# EAGLE design modular_expansion_system_base_smd (EAGLE 9.2.1)
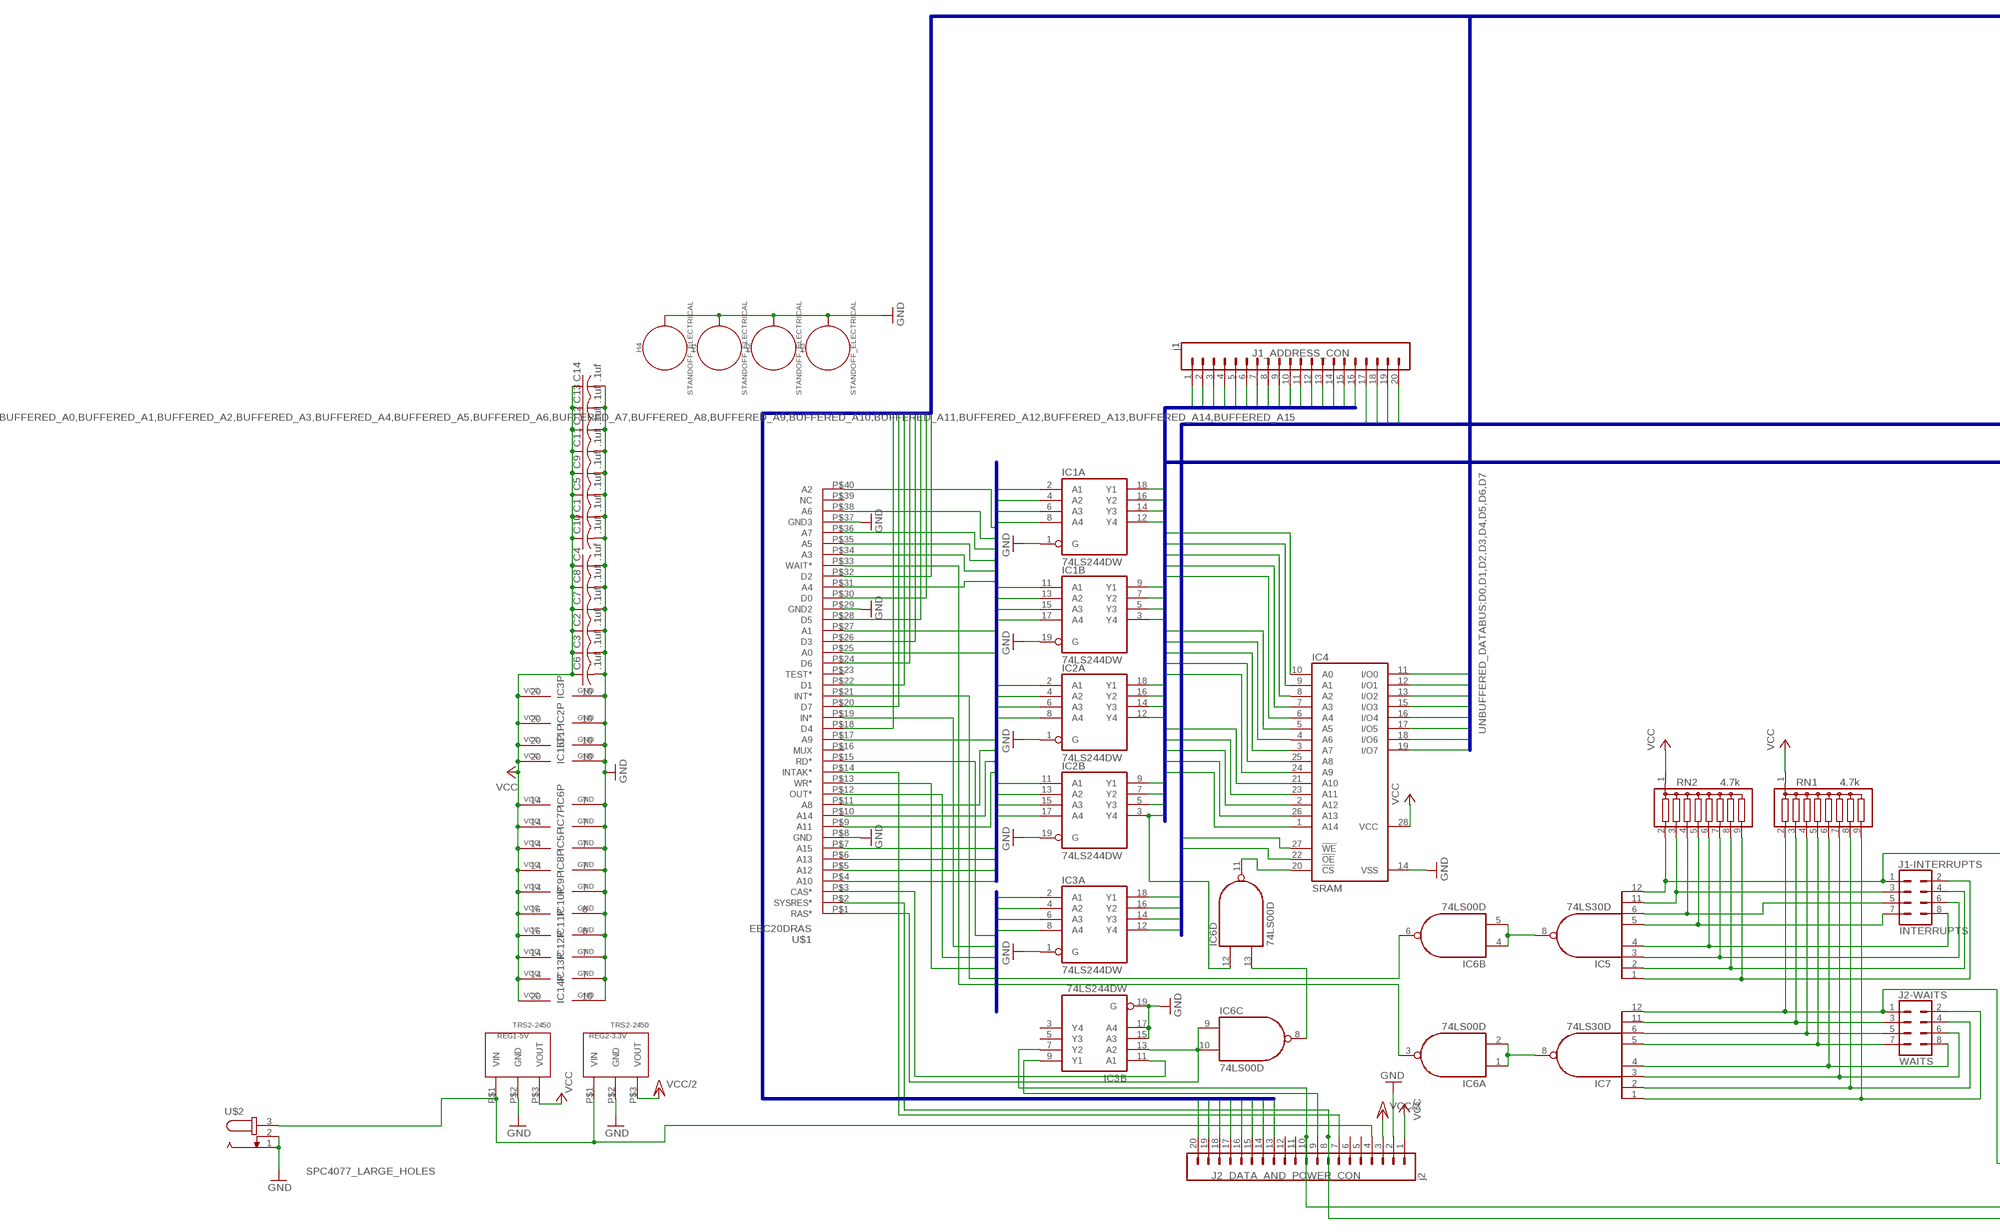
[diagram p0: schematic, sheet 1, part 1 of 3]
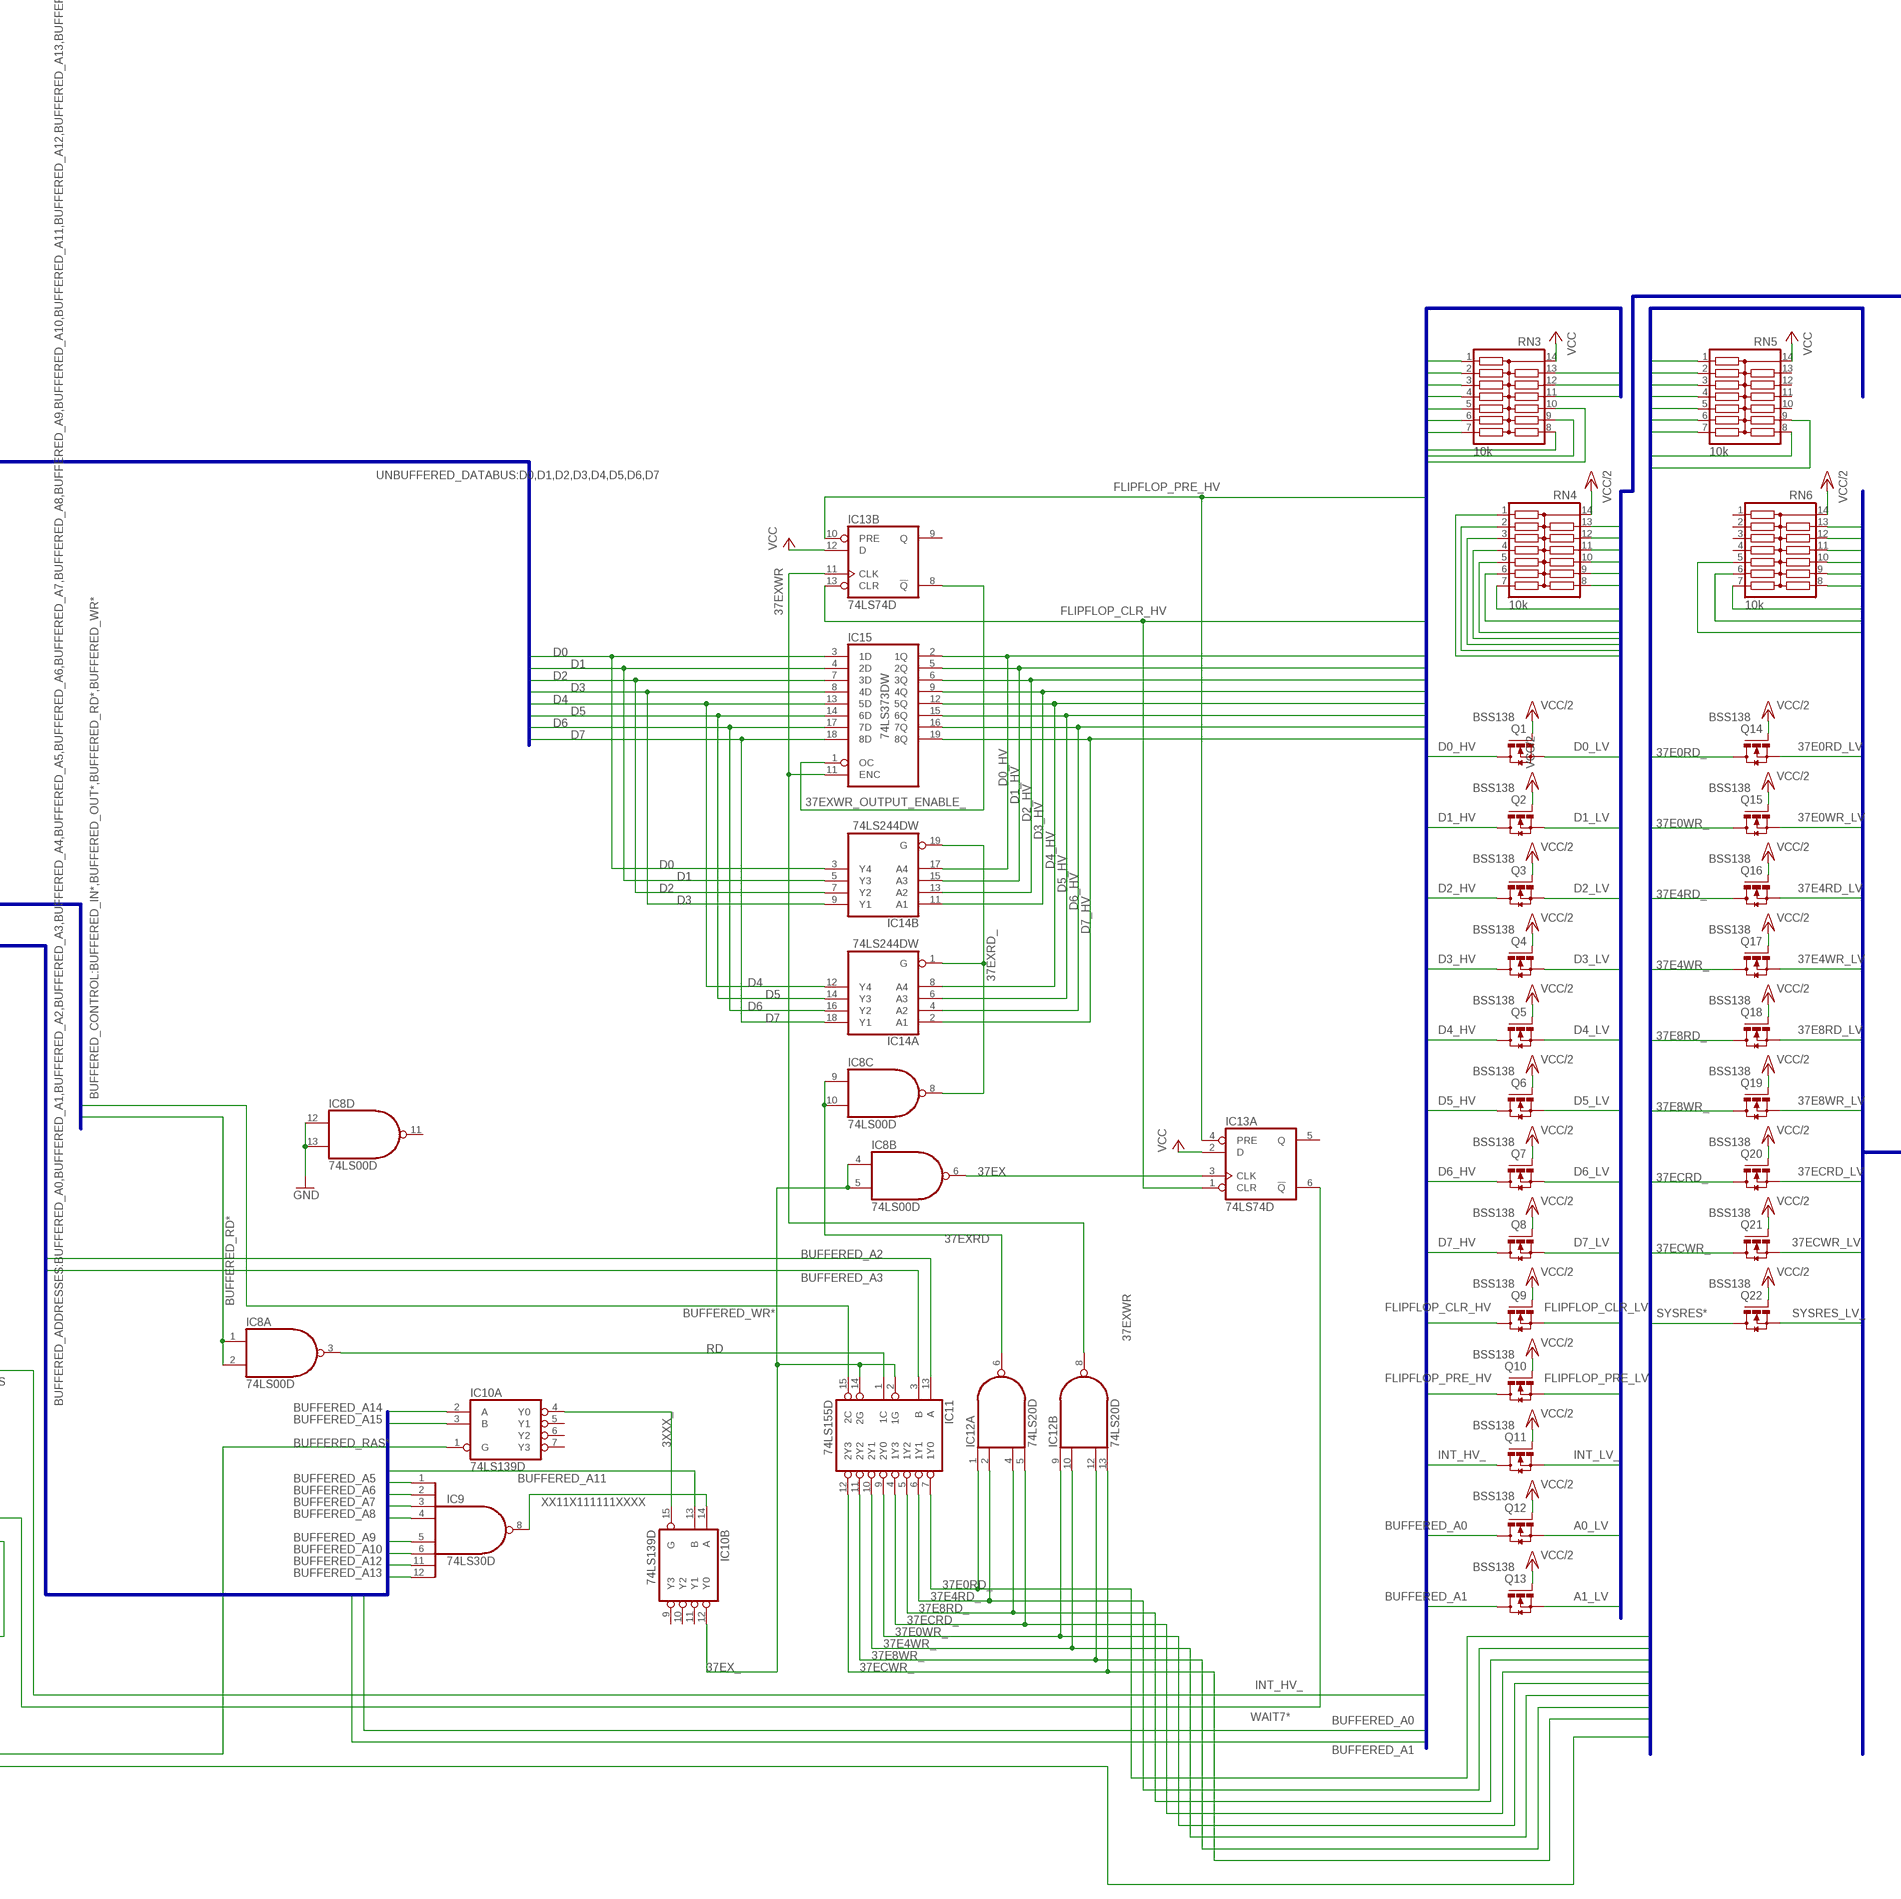
[diagram p1: schematic, sheet 1, part 2 of 3]
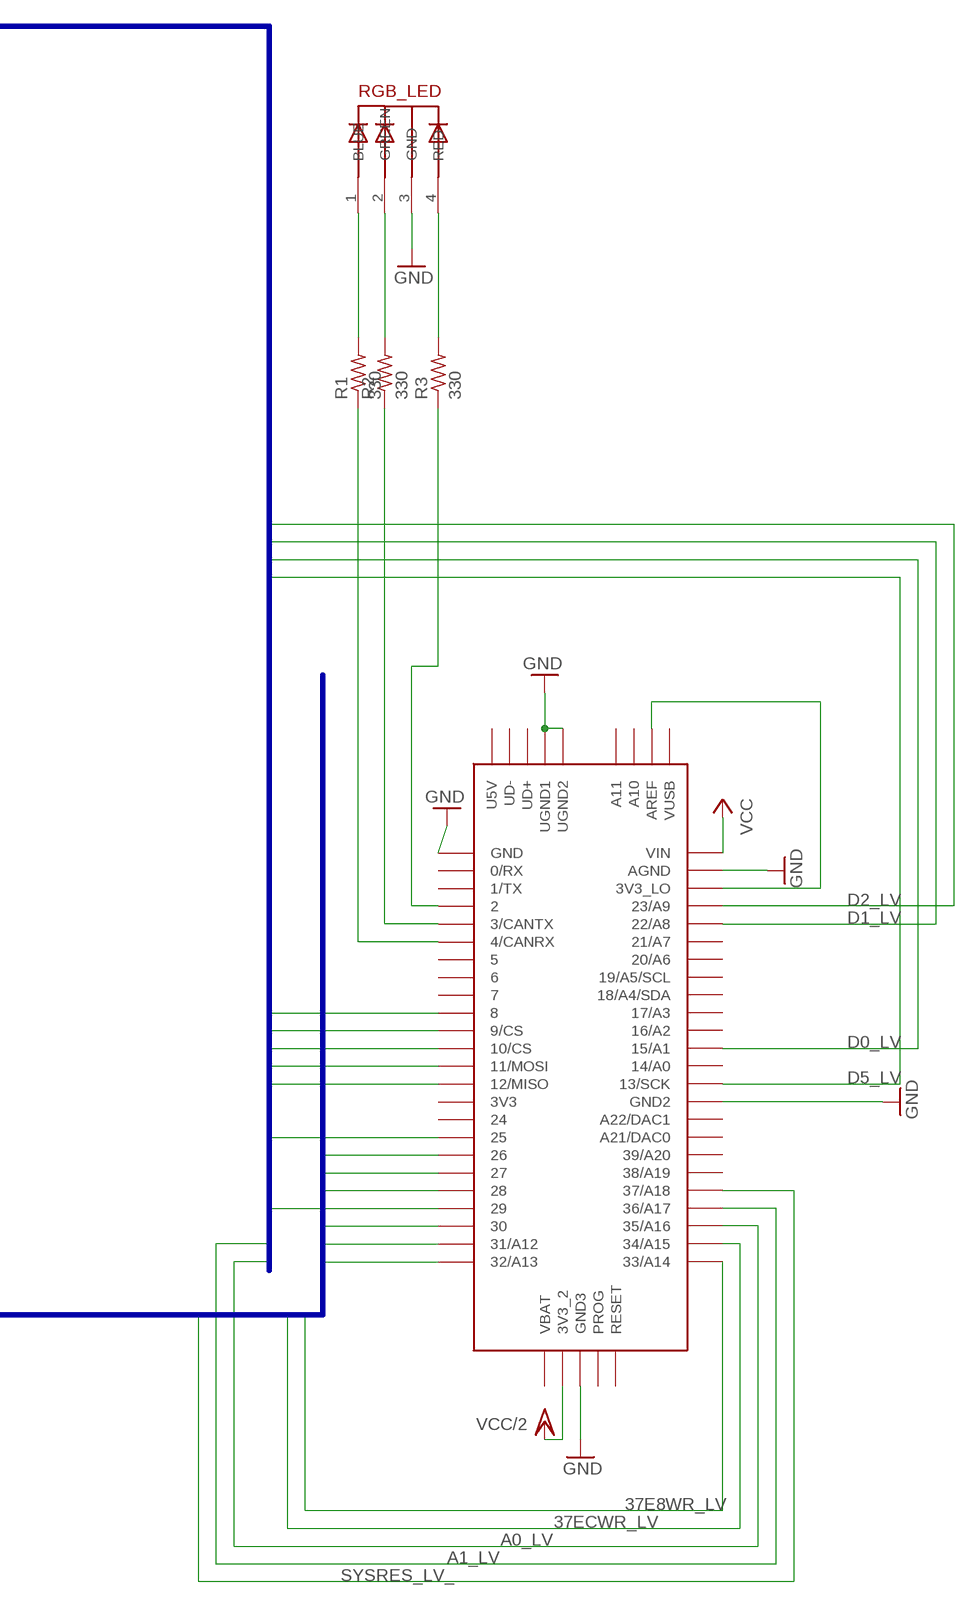
[diagram p2: schematic, sheet 1, part 3 of 3]

## Parts
C1  .1uf  C-US025-025X050  [C025-025X050]
C2  .1uf  C-US025-025X050  [C025-025X050]
C3  .1uf  C-US025-025X050  [C025-025X050]
C4  .1uf  C-US025-025X050  [C025-025X050]
C5  .1uf  C-US025-025X050  [C025-025X050]
C6  .1uf  C-US025-025X050  [C025-025X050]
C7  .1uf  C-US025-025X050  [C025-025X050]
C8  .1uf  C-US025-025X050  [C025-025X050]
C9  .1uf  C-US025-025X050  [C025-025X050]
C10  .1uf  C-US025-025X050  [C025-025X050]
C11  .1uf  C-US025-025X050  [C025-025X050]
C12  .1uf  C-US025-025X050  [C025-025X050]
C13  .1uf  C-US025-025X050  [C025-025X050]
C14  .1uf  C-US025-025X050  [C025-025X050]
H1  STANDOFF_ELECTRICAL  [STANDOFF-ELECTRICAL]
H2  STANDOFF_ELECTRICAL  [STANDOFF-ELECTRICAL]
H3  STANDOFF_ELECTRICAL  [STANDOFF-ELECTRICAL]
H4  STANDOFF_ELECTRICAL  [STANDOFF-ELECTRICAL]
IC1  74LS244DW  [SO20W]
IC2  74LS244DW  [SO20W]
IC3  74LS244DW  [SO20W]
IC4  SRAM  62256FP  [SO28L]
IC5  74LS30D  [SO14]
IC6  74LS00D  [SO14]
IC7  74LS30D  [SO14]
IC8  74LS00D  [SO14]
IC9  74LS30D  [SO14]
IC10  74LS139D  [SO16]
IC11  74LS155D  [SO16]
IC12  74LS20D  [SO14]
IC13  74LS74D  [SO14]
IC14  74LS244DW  [SO20W]
IC15  74LS373DW  [SO20W]
J1-INTERRUPTS  INTERRUPTS  CONN_04X2  [2X4]
J1_ADDRESS_CON  j1  CONN_20  [1X20]
J2-WAITS  WAITS  CONN_04X2  [2X4]
J2_DATA_AND_POWER_CON  j2  CONN_20  [1X20]
Q1  BSS138  [SOT23-3]
Q2  BSS138  [SOT23-3]
Q3  BSS138  [SOT23-3]
Q4  BSS138  [SOT23-3]
Q5  BSS138  [SOT23-3]
Q6  BSS138  [SOT23-3]
Q7  BSS138  [SOT23-3]
Q8  BSS138  [SOT23-3]
Q9  BSS138  [SOT23-3]
Q10  BSS138  [SOT23-3]
Q11  BSS138  [SOT23-3]
Q12  BSS138  [SOT23-3]
Q13  BSS138  [SOT23-3]
Q14  BSS138  [SOT23-3]
Q15  BSS138  [SOT23-3]
Q16  BSS138  [SOT23-3]
Q17  BSS138  [SOT23-3]
Q18  BSS138  [SOT23-3]
Q19  BSS138  [SOT23-3]
Q20  BSS138  [SOT23-3]
Q21  BSS138  [SOT23-3]
Q22  BSS138  [SOT23-3]
R1  330  R-US_0207/2V  [0207/2V]
R2  330  R-US_0207/2V  [0207/2V]
R3  330  R-US_0207/2V  [0207/2V]
REG1-5V  TRS2-2450  [TRACON_REG]
REG2-3.3V  TRS2-2450  [TRACON_REG]
RGB_LED  5MMRGBLED  [LED5MMRGB]
RN1  4.7k  G08R  [SIL9]
RN2  4.7k  G08R  [SIL9]
RN3  10k  13RSOMC  [SOMC14]
RN4  10k  13RSOMC  [SOMC14]
RN5  10k  13RSOMC  [SOMC14]
RN6  10k  13RSOMC  [SOMC14]
U$1  EBC20DRAS  [EBC20DRAS]
U$2  SPC4077_LARGE_HOLES  [SPC4077]
U$3  TEENSY_3.5/3.6  [TEENSY_3.5/3.6]

## Nets
3XXX_: IC10.4(A:Y0) IC10.15(B:G)
9V-IN: J2_DATA_AND_POWER_CON.4 REG1-5V.P$1(VIN) REG2-3.3V.P$1(VIN) U$2.3
37E0RD_: IC11.7(1Y0) IC12.1(A:I0) Q14.3(D) RN5.1
37E0RD_LV: Q14.2(S) RN6.13 U$3.31/A12
37E0WR_: IC11.9(2Y0) IC12.9(B:I0) Q15.3(D) RN5.2
37E0WR_LV: Q15.2(S) RN6.12 U$3.27
37E4RD_: IC11.6(1Y1) IC12.2(A:I1) Q16.3(D) RN5.3
37E4RD_LV: Q16.2(S) RN6.11 U$3.32/A13
37E4WR_: IC11.10(2Y1) IC12.10(B:I1) Q17.3(D) RN5.4
37E4WR_LV: Q17.2(S) RN6.10 U$3.28
37E8RD_: IC11.5(1Y2) IC12.4(A:I2) Q18.3(D) RN5.5
37E8RD_LV: Q18.2(S) RN6.9 U$3.30
37E8WR_: IC11.11(2Y2) IC12.12(B:I2) Q19.3(D) RN5.6
37E8WR_LV: Q19.2(S) RN6.8 U$3.33/A14
37ECRD_: IC11.4(1Y3) IC12.5(A:I3) Q20.3(D) RN5.7
37ECRD_LV: Q20.2(S) RN6.7 U$3.26
37ECWR_: IC11.12(2Y3) IC12.13(B:I3) Q21.3(D) RN5.8
37ECWR_LV: Q21.2(S) RN6.6 U$3.34/A15
37EX: IC8.6(B:O) IC13.3(A:CLK)
37EX_: IC8.4(B:I0) IC8.5(B:I1) IC10.12(B:Y0) IC11.2(1G) IC11.14(2G)
37EXRD: IC8.9(C:I0) IC8.10(C:I1) IC12.6(A:O)
37EXRD_: IC8.8(C:O) IC14.1(A:G) IC14.19(B:G)
37EXWR: IC12.8(B:O) IC13.11(B:CLK) IC15.11(ENC)
37EXWR_OUTPUT_ENABLE_: IC13.8(B:!Q) IC15.1(OC)
A0: IC1.2(A:A1) U$1.P$25(A0)
A0_LV: Q12.2(S) RN4.2 U$3.35/A16
A1: IC1.4(A:A2) U$1.P$27(A1)
A1_LV: Q13.2(S) RN4.1 U$3.36/A17
A2: IC1.6(A:A3) U$1.P$40(A2)
A3: IC1.8(A:A4) U$1.P$34(A3)
A4: IC1.11(B:A1) U$1.P$31(A4)
A5: IC1.13(B:A2) U$1.P$35(A5)
A6: IC1.15(B:A3) U$1.P$38(A6)
A7: IC1.17(B:A4) U$1.P$36(A7)
A8: IC2.2(A:A1) U$1.P$11(A8)
A9: IC2.4(A:A2) U$1.P$17(A9)
A10: IC2.6(A:A3) U$1.P$4(A10)
A11: IC2.8(A:A4) U$1.P$9(A11)
A12: IC2.11(B:A1) U$1.P$5(A12)
A13: IC2.13(B:A2) U$1.P$6(A13)
A14: IC2.15(B:A3) U$1.P$10(A14)
A15: IC2.17(B:A4) U$1.P$7(A15)
A15_AND_RAS: IC4.20(!CS) IC6.11(D:O)
BUFFERED_A0: IC1.18(A:Y1) IC4.10(A0) J1_ADDRESS_CON.1 Q12.3(D) RN3.12
BUFFERED_A1: IC1.16(A:Y2) IC4.9(A1) J1_ADDRESS_CON.2 Q13.3(D) RN3.13
BUFFERED_A2: IC1.14(A:Y3) IC4.8(A2) IC11.13(A) J1_ADDRESS_CON.3
BUFFERED_A3: IC1.12(A:Y4) IC4.7(A3) IC11.3(B) J1_ADDRESS_CON.4
BUFFERED_A4: IC1.9(B:Y1) IC4.6(A4) J1_ADDRESS_CON.5
BUFFERED_A5: IC1.7(B:Y2) IC4.5(A5) IC9.1(I0) J1_ADDRESS_CON.6
BUFFERED_A6: IC1.5(B:Y3) IC4.4(A6) IC9.2(I1) J1_ADDRESS_CON.7
BUFFERED_A7: IC1.3(B:Y4) IC4.3(A7) IC9.3(I2) J1_ADDRESS_CON.8
BUFFERED_A8: IC2.18(A:Y1) IC4.25(A8) IC9.4(I3) J1_ADDRESS_CON.9
BUFFERED_A9: IC2.16(A:Y2) IC4.24(A9) IC9.5(I4) J1_ADDRESS_CON.10
BUFFERED_A10: IC2.14(A:Y3) IC4.21(A10) IC9.6(I5) J1_ADDRESS_CON.11
BUFFERED_A11: IC2.12(A:Y4) IC4.23(A11) IC10.13(B:B) J1_ADDRESS_CON.12
BUFFERED_A12: IC2.9(B:Y1) IC4.2(A12) IC9.11(I6) J1_ADDRESS_CON.13
BUFFERED_A13: IC2.7(B:Y2) IC4.26(A13) IC9.12(I7) J1_ADDRESS_CON.14
BUFFERED_A14: IC2.5(B:Y3) IC4.1(A14) IC10.2(A:A) J1_ADDRESS_CON.15
BUFFERED_A15: IC2.3(B:Y4) IC6.12(D:I0) IC10.3(A:B) J1_ADDRESS_CON.16
BUFFERED_CAS*: IC3.9(B:Y1) J2_DATA_AND_POWER_CON.9
BUFFERED_IN*: IC3.14(A:Y3) J1_ADDRESS_CON.17
BUFFERED_OUT*: IC3.12(A:Y4) J1_ADDRESS_CON.18
BUFFERED_RAS*: IC3.7(B:Y2) IC10.1(A:G) J2_DATA_AND_POWER_CON.10
BUFFERED_RD*: IC3.18(A:Y1) IC4.22(!OE) IC8.1(A:I0) IC8.2(A:I1) J1_ADDRESS_CON.19
BUFFERED_WR*: IC3.16(A:Y2) IC4.27(!WE) IC11.15(2C) J1_ADDRESS_CON.20
CAS*: IC3.11(B:A1) U$1.P$3(CAS*)
D0: IC4.11(I/O0) IC14.3(B:Y4) IC15.3(1D) J2_DATA_AND_POWER_CON.20 U$1.P$30(D0)
D0_HV: IC14.17(B:A4) IC15.2(1Q) Q1.3(D) RN3.1
D0_LV: Q1.2(S) RN4.13 U$3.15/A1
D1: IC4.12(I/O1) IC14.5(B:Y3) IC15.4(2D) J2_DATA_AND_POWER_CON.19 U$1.P$22(D1)
D1_HV: IC14.15(B:A3) IC15.5(2Q) Q2.3(D) RN3.2
D1_LV: Q2.2(S) RN4.12 U$3.22/A8
D2: IC4.13(I/O2) IC14.7(B:Y2) IC15.7(3D) J2_DATA_AND_POWER_CON.18 U$1.P$32(D2)
D2_HV: IC14.13(B:A2) IC15.6(3Q) Q3.3(D) RN3.3
D2_LV: Q3.2(S) RN4.11 U$3.23/A9
D3: IC4.15(I/O3) IC14.9(B:Y1) IC15.8(4D) J2_DATA_AND_POWER_CON.17 U$1.P$26(D3)
D3_HV: IC14.11(B:A1) IC15.9(4Q) Q4.3(D) RN3.4
D3_LV: Q4.2(S) RN4.10 U$3.9/CS
D4: IC4.16(I/O4) IC14.12(A:Y4) IC15.13(5D) J2_DATA_AND_POWER_CON.16 U$1.P$18(D4)
D4_HV: IC14.8(A:A4) IC15.12(5Q) Q5.3(D) RN3.5
D4_LV: Q5.2(S) RN4.9 U$3.10/CS
D5: IC4.17(I/O5) IC14.14(A:Y3) IC15.14(6D) J2_DATA_AND_POWER_CON.15 U$1.P$28(D5)
D5_HV: IC14.6(A:A3) IC15.15(6Q) Q6.3(D) RN3.6
D5_LV: Q6.2(S) RN4.8 U$3.13/SCK
D6: IC4.18(I/O6) IC14.16(A:Y2) IC15.17(7D) J2_DATA_AND_POWER_CON.14 U$1.P$24(D6)
D6_HV: IC14.4(A:A2) IC15.16(7Q) Q7.3(D) RN3.7
D6_LV: Q7.2(S) RN4.7 U$3.11/MOSI
D7: IC4.19(I/O7) IC14.18(A:Y1) IC15.18(8D) J2_DATA_AND_POWER_CON.13 U$1.P$20(D7)
D7_HV: IC14.2(A:A1) IC15.19(8Q) Q8.3(D) RN3.8
D7_LV: Q8.2(S) RN4.6 U$3.12/MISO
FLIPFLOP_CLR_HV: IC13.1(A:CLR) IC13.13(B:CLR) Q9.3(D) RN3.9
FLIPFLOP_CLR_LV: Q9.2(S) RN4.5 U$3.25
FLIPFLOP_PRE_HV: IC13.4(A:PRE) IC13.10(B:PRE) Q10.3(D) RN3.10
FLIPFLOP_PRE_LV: Q10.2(S) RN4.4 U$3.29
GND: C1.2 C2.2 C3.2 C4.2 C5.2 C6.2 C7.2 C8.2 C9.2 C10.2 C11.2 C12.2 C13.2 C14.2 H1.P1 H2.P1 H3.P1 H4.P1 IC1.1(A:G) IC1.10(P:GND) IC1.19(B:G) IC2.1(A:G) IC2.10(P:GND) IC2.19(B:G) IC3.1(A:G) IC3.10(P:GND) IC3.15(B:A3) IC3.17(B:A4) IC3.19(B:G) IC4.14(VSS) IC5.7(GND) IC6.7(P:GND) IC7.7(GND) IC8.7(P:GND) IC8.12(D:I0) IC8.13(D:I1) IC9.7(GND) IC10.8(P:GND) IC11.8(GND) IC12.7(P:GND) IC13.7(P:GND) IC14.10(P:GND) IC15.10(GND) J2_DATA_AND_POWER_CON.2 REG1-5V.P$2(GND) REG2-3.3V.P$2(GND) RGB_LED.3(GND) U$1.P$8(GND) U$1.P$29(GND2) U$1.P$37(GND3) U$2.1 U$2.2 U$3.AGND U$3.GND U$3.GND2 U$3.GND3 U$3.UGND1 U$3.UGND2
IN*: IC3.6(A:A3) U$1.P$19(IN*)
INT: IC5.8(O) IC6.4(B:I0) IC6.5(B:I1)
INT1*: IC5.11(I6) J1-INTERRUPTS.3 RN2.3
INT2*: IC5.6(I5) J1-INTERRUPTS.5 RN2.4
INT3*: IC5.5(I4) J1-INTERRUPTS.7 RN2.5
INT4*: IC5.1(I0) J1-INTERRUPTS.2 RN2.9
INT5*: IC5.2(I1) J1-INTERRUPTS.4 RN2.8
INT6*: IC5.3(I2) J1-INTERRUPTS.6 RN2.7
INT7*: IC5.4(I3) J1-INTERRUPTS.8 RN2.6
INT*: IC6.6(B:O) U$1.P$21(INT*)
INT_HV_: IC5.12(I7) J1-INTERRUPTS.1 Q11.3(D) RN2.2 RN3.11
INT_LV_: Q11.2(S) RN4.3 U$3.8
INTAK*: J2_DATA_AND_POWER_CON.7 U$1.P$14(INTAK*)
N$1: U$3.3V3_LO U$3.AREF
N$2: R1.2 RGB_LED.1(BLUE)
N$3: R2.2 RGB_LED.2(GREEN)
N$4: R3.2 RGB_LED.4(RED)
N$5: R3.1 U$3.2
N$6: R2.1 U$3.3/CANTX
N$7: R1.1 U$3.4/CANRX
OUT*: IC3.8(A:A4) U$1.P$12(OUT*)
RAS: IC6.8(C:O) IC6.13(D:I1)
RAS*: IC3.13(B:A2) IC6.9(C:I0) IC6.10(C:I1) U$1.P$1(RAS*)
RD: IC8.3(A:O) IC11.1(1C)
RD*: IC3.2(A:A1) U$1.P$15(RD*)
SYSRES*: J2_DATA_AND_POWER_CON.8 Q22.3(D) RN5.9 U$1.P$2(SYSRES*)
SYSRES_LV_: Q22.2(S) RN6.5 U$3.37/A18
VCC: C1.1 C2.1 C3.1 C4.1 C5.1 C6.1 C7.1 C8.1 C9.1 C10.1 C11.1 C12.1 C13.1 C14.1 IC1.20(P:VCC) IC2.20(P:VCC) IC3.20(P:VCC) IC4.28(VCC) IC5.14(VCC) IC6.14(P:VCC) IC7.14(VCC) IC8.14(P:VCC) IC9.14(VCC) IC10.16(P:VCC) IC11.16(VCC) IC12.14(P:VCC) IC13.2(A:D) IC13.12(B:D) IC13.14(P:VCC) IC14.20(P:VCC) IC15.20(VCC) J2_DATA_AND_POWER_CON.1 REG1-5V.P$3(VOUT) RN1.1 RN2.1 RN3.14 RN5.14 U$3.VIN
VCC/2: J2_DATA_AND_POWER_CON.3 Q1.1(G) Q2.1(G) Q3.1(G) Q4.1(G) Q5.1(G) Q6.1(G) Q7.1(G) Q8.1(G) Q9.1(G) Q10.1(G) Q11.1(G) Q12.1(G) Q13.1(G) Q14.1(G) Q15.1(G) Q16.1(G) Q17.1(G) Q18.1(G) Q19.1(G) Q20.1(G) Q21.1(G) Q22.1(G) REG2-3.3V.P$3(VOUT) RN4.14 RN6.14 U$3.3V3_2
WAIT: IC6.1(A:I0) IC6.2(A:I1) IC7.8(O)
WAIT0*: IC7.4(I3) J2-WAITS.8 RN1.6
WAIT1*: IC7.3(I2) J2-WAITS.6 RN1.7
WAIT2*: IC7.2(I1) J2-WAITS.4 RN1.8
WAIT3*: IC7.1(I0) J2-WAITS.2 RN1.9
WAIT4*: IC7.5(I4) J2-WAITS.7 RN1.5
WAIT5*: IC7.6(I5) J2-WAITS.5 RN1.4
WAIT6*: IC7.11(I6) J2-WAITS.3 RN1.3
WAIT7*: IC7.12(I7) IC13.6(A:!Q) J2-WAITS.1 RN1.2
WAIT*: IC6.3(A:O) U$1.P$33(WAIT*)
WR*: IC3.4(A:A2) U$1.P$13(WR*)
XX11X111111XXXX: IC9.8(O) IC10.14(B:A)
Unconnected: IC3.3(B:Y4) IC3.5(B:Y3) IC8.11(D:O) IC10.5(A:Y1) IC10.6(A:Y2) IC10.7(A:Y3) IC10.9(B:Y3) IC10.10(B:Y2) IC10.11(B:Y1) IC13.5(A:Q) IC13.9(B:Q) J2_DATA_AND_POWER_CON.5 J2_DATA_AND_POWER_CON.6 J2_DATA_AND_POWER_CON.11 J2_DATA_AND_POWER_CON.12 RN5.10 RN5.11 RN5.12 RN5.13 RN6.1 RN6.2 RN6.3 RN6.4 U$1.P$16(MUX) U$1.P$23(TEST*) U$1.P$39(NC) U$3.0/RX U$3.1/TX U$3.3V3 U$3.5 U$3.6 U$3.7 U$3.14/A0 U$3.16/A2 U$3.17/A3 U$3.18/A4/SDA U$3.19/A5/SCL U$3.20/A6 U$3.21/A7 U$3.21/DAC0(A21/DAC0) U$3.24 U$3.38/A19 U$3.39/A20 U$3.A10 U$3.A11 U$3.A22/DAC1 U$3.PROG U$3.RESET U$3.U5V U$3.UD+ U$3.UD- U$3.VBAT U$3.VUSB

## Buses
UNBUFFERED_DATABUS:D0,D1,D2,D3,D4,D5,D6,D7
UNBUFFERED_CONTROL:IN*,OUT*,RD*,WR*
BUFFERED_CONTROL:BUFFERED_IN*,BUFFERED_OUT*,BUFFERED_RD*,BUFFERED_WR*
BUFFERED_ADDRESSES:BUFFERED_A0,BUFFERED_A1,BUFFERED_A2,BUFFERED_A3,BUFFERED_A4,BUFFERED_A5,BUFFERED_A6,BUFFERED_A7,BUFFERED_A8,BUFFERED_A9,BUFFERED_A10,BUFFERED_A11,BUFFERED_A12,BUFFERED_A13,BUFFERED_A14,BUFFERED_A15
UNBUFFERED_ADDRESSBUS:A0,A1,A2,A3,A4,A5,A6,A7,A8,A9,A10,A11,A12,A13,A14,A15
BUFFERED_A0,BUFFERED_A1,D0_HV,D1_HV,D2_HV,D3_HV,D4_HV,D5_HV,D6_HV,D7_HV,FLIPFLOP_CLR_HV,FLIPFLOP_PRE_HV,INT_HV_
A0_LV,A1_LV,D0_LV,D1_LV,D2_LV,D3_LV,D4_LV,D5_LV,D6_LV,D7_LV,FLIPFLOP_CLR_LV,FLIPFLOP_PRE_LV,INT_LV_
37E0RD_,37E0WR_,37E4RD_,37E4WR_,37E8RD_,37E8WR_,37ECRD_,37ECWR_,SYSRES*
37E0RD_LV,37E0WR_LV,37E4RD_LV,37E4WR_LV,37E8RD_LV,37E8WR_LV,37ECRD_LV,37ECWR_LV,SYSRES_LV_

## Library data of the parts
C1-C14 = rcl:C-US: CAPACITOR, American symbol; SPICEPREFIX: C
H1-H4 = SparkFun-Hardware:STANDOFF_ELECTRICAL: Stand Off Drill holes with an electrical connection. For example, use these to ground your board to a chassis. Example SparkFun Products Screw - Phillips Head (1/4", 4-40, 10 pack) <https://www.sparkfun.com/products/10453> (PRT-10453) Screw - Phillips Head (1/2", 4-40, 10 pack) <https://www.sparkfun.com/products/10452> (PRT-10452) Screw - Phillips Head (3/4", 4-40, 10 pack) <https://www.sparkfun.com/products/10451> (PRT-10451) Screw - Phillips Head (1", 4-40, 10 pack) <https://www.sparkfun.com/products/10450> (PRT-10450)
IC1-IC3 IC14 = 74xx-us:74*244: Octal BUFFER and LINE DRIVER, 3-state
IC4 = memory-hitachi:62256FP: MEMORY; MPN: CY62256VNLL-70SNXI; OC_FARNELL: 1650073; OC_NEWARK: 19M2582
IC5 IC7 IC9 = 74xx-us:74*30: 8-input NAND gate
IC6 IC8 = 74xx-us:74*00: Quad 2-input NAND gate
IC10 = 74xx-us:74*139: Dual 2-line to 4-line DECODER/DEMULTIPLEXER
IC11 = 74xx-us:74*155: Dual 2-line to 4-line data DECODER/DEMULTIPLEXER
IC12 = 74xx-us:74*20: Dual 4-input NAND gate
IC13 = 74xx-us:74*74: Dual D type positive edge triggered FLIP FLOP, preset and clear
IC15 = 74xx-us:74*373: Octal D type transparent LATCH, edge triggered
J1-INTERRUPTS J2-WAITS = SparkFun-Connectors:CONN_04X2: Multi connection point. Often used as Generic Header-pin footprint for 0.1 inch spaced/style header connections On any of the 0.1 inch spaced packages, you can populate with these: Break Away Headers - Straight <https://www.sparkfun.com/products/116> (PRT-00116) Break Away Male Headers - Right Angle <https://www.sparkfun.com/products/553> (PRT-00553) Female Headers <https://www.sparkfun.com/products/115> (PRT-00115) Break Away Headers - Machine Pin <https://www.sparkfun.com/products/117> (PRT-00117) Break Away Female Headers - Swiss Machine Pin <https://www.sparkfun.com/products/743> (PRT-00743)
J1_ADDRESS_CON J2_DATA_AND_POWER_CON = SparkFun-Connectors:CONN_20: Multi connection point. Often used as Generic Header-pin footprint for 0.1 inch spaced/style header connections On any of the 0.1 inch spaced packages, you can populate with these: Break Away Headers - Straight <https://www.sparkfun.com/products/116> (PRT-00116) Break Away Male Headers - Right Angle <https://www.sparkfun.com/products/553> (PRT-00553) Female Headers <https://www.sparkfun.com/products/115> (PRT-00115) Break Away Headers - Machine Pin <https://www.sparkfun.com/products/117> (PRT-00117) Break Away Female Headers - Swiss Machine Pin <https://www.sparkfun.com/products/743> (PRT-00743) For SCREWTERMINALS and SPRING TERMINALS visit here: Screw Terimnals on SparkFun.com <https://www.sparkfun.com/search/results?term=Screw+Terminals> (5mm/3.5mm/2.54mm spacing) This device is also useful as a general connection point to wire up your design to another part of your project. Our various solder wires solder well into these plated through hole pads. Hook-Up Wire - Assortment (Stranded, 22 AWG) <https://www.sparkfun.com/products/11375> (PRT-11375) Hook-Up Wire - Assortment (Solid Core, 22 AWG) <https://www.sparkfun.com/products/11367> (PRT-11367) View the entire wire category on our website here <https://www.sparkfun.com/categories/141> Special notes: Molex polarized connector foot print use with SKU : PRT-08231 with associated crimp pins and housings. 1MM SMD Version SKU: PRT-10208 NOTES ON THE VARIANTS LOCK and LOCK_LONGPADS... This footprint was designed to help hold the alignment of a through-hole component (i.e. 6-pin header) while soldering it into place. You may notice that each hole has been shifted either up or down by 0.005 of an inch from it's more standard position (which is a perfectly straight line). This slight alteration caused the pins (the squares in the middle) to touch the edges of the holes. Because they are alternating, it causes a "brace" to hold the component in place. 0.005 has proven to be the perfect amount of "off-center" position when using our standard breakaway headers. Although looks a little odd when you look at the bare footprint, once you have a header in there, the alteration is very hard to notice. Also,if you push a header all the way into place, it is covered up entirely on the bottom side. Note about LOCK SPECIAL package: This is just like the LOCK variant in that the holes are staggared by 5 mil, but except for the last two holes. They are not altered from the "standard" footprint layout. This is used for a special purpose on the layout of our Graphic LCD Backpack. Make sure you want to use this device before selecting it for you project!
Q1-Q22 = Transistor:BSS138: MOSFET N-CH 50V 220MA SOT-23 Manufacturer's datasheet <https://www.onsemi.com/pub/Collateral/BSS138-D.PDF>; CREATED_BY: PCBLayout.com; DIGIKEY_PART_NUMBER: BSS138CT-ND; MANUFACTURER: ON Semiconductor; MPN: BSS138; PACKAGE: SOT-23
R1-R3 = resistor:R-US_: RESISTOR, American symbol
REG1-5V REG2-3.3V = TMS99:TRS2-2450: 5V TRACO regulator
RGB_LED = adafruit:5MMRGBLED
RN1 RN2 = resistor-sil:G08R: SIL RESISTOR; OC_FARNELL: unknown; OC_NEWARK: unknown
RN3-RN6 = resistor-dil:13R: DIL RESISTOR; MPN: SOMC140313R0GEJ; OC_FARNELL: unknown; OC_NEWARK: 48P4478
U$1 = TMS99:EBC20DRAS
U$2 = con-jack:SPC4077_LARGE_HOLES
U$3 = Teensy356:TEENSY_3.5/3.6

## Net classes
0 default: width 0.3 mm

## Board
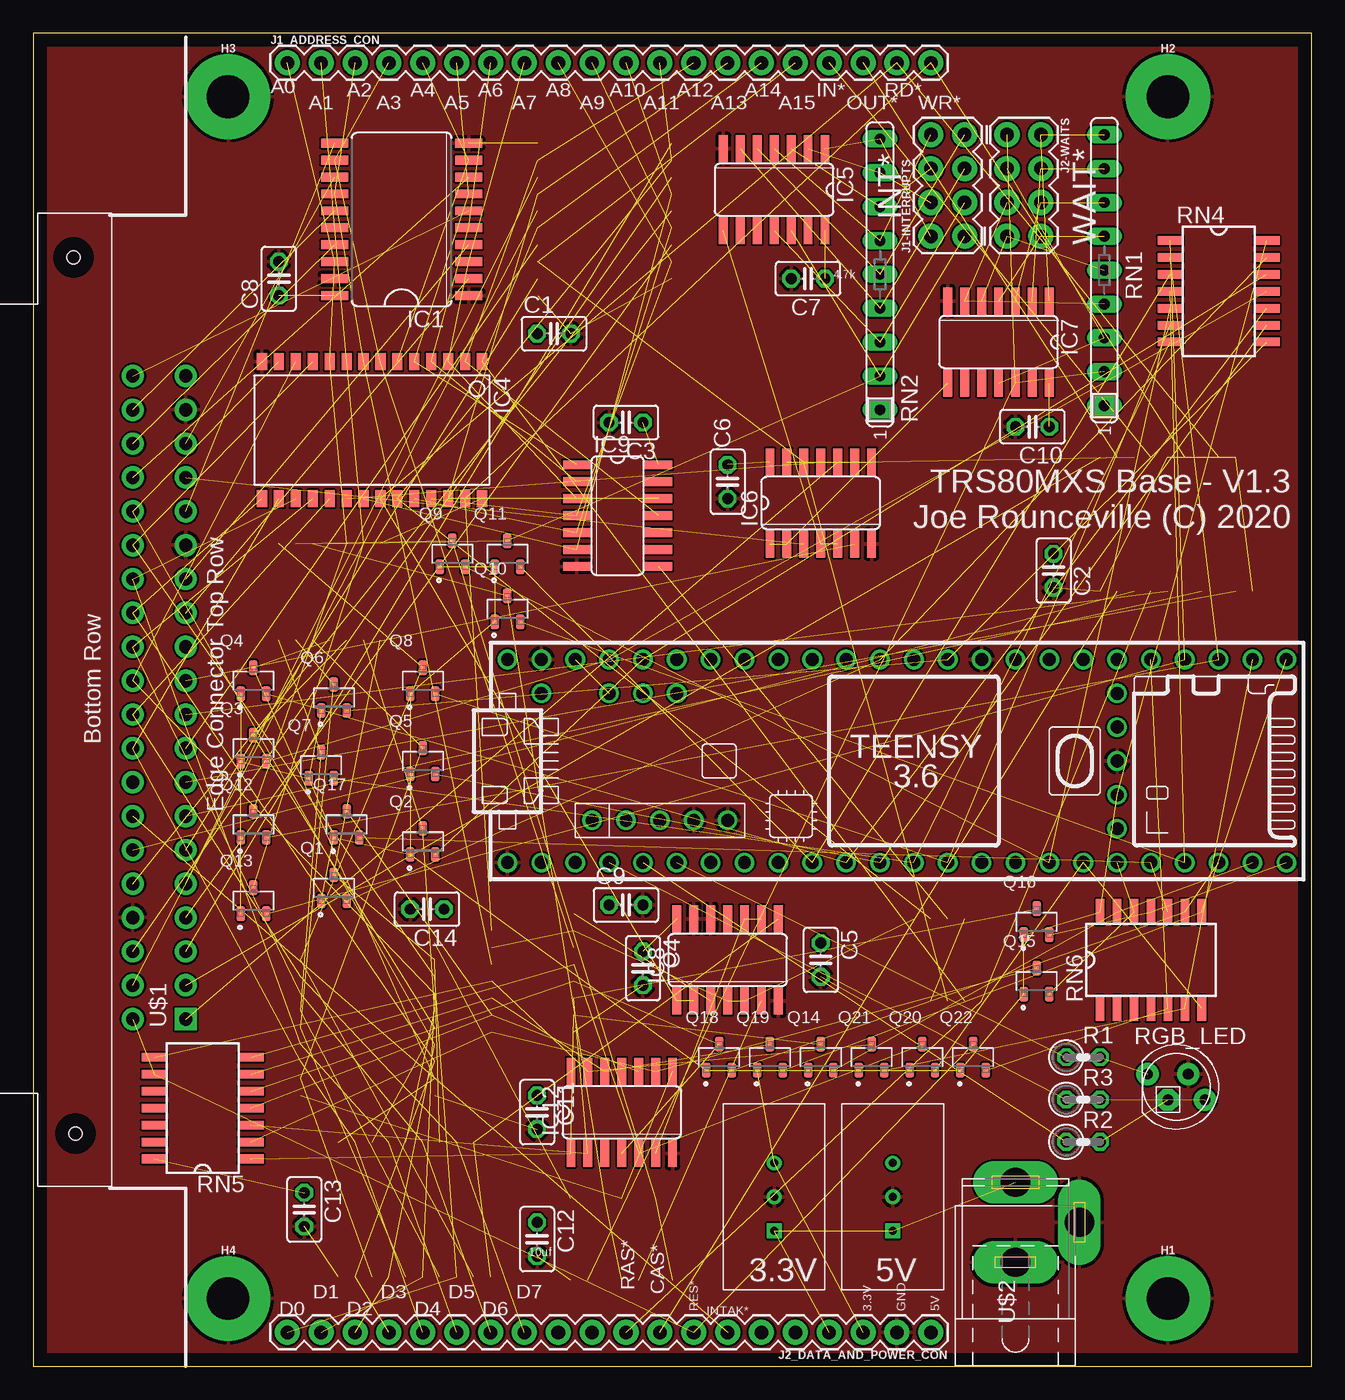
[diagram p3: board, top side]
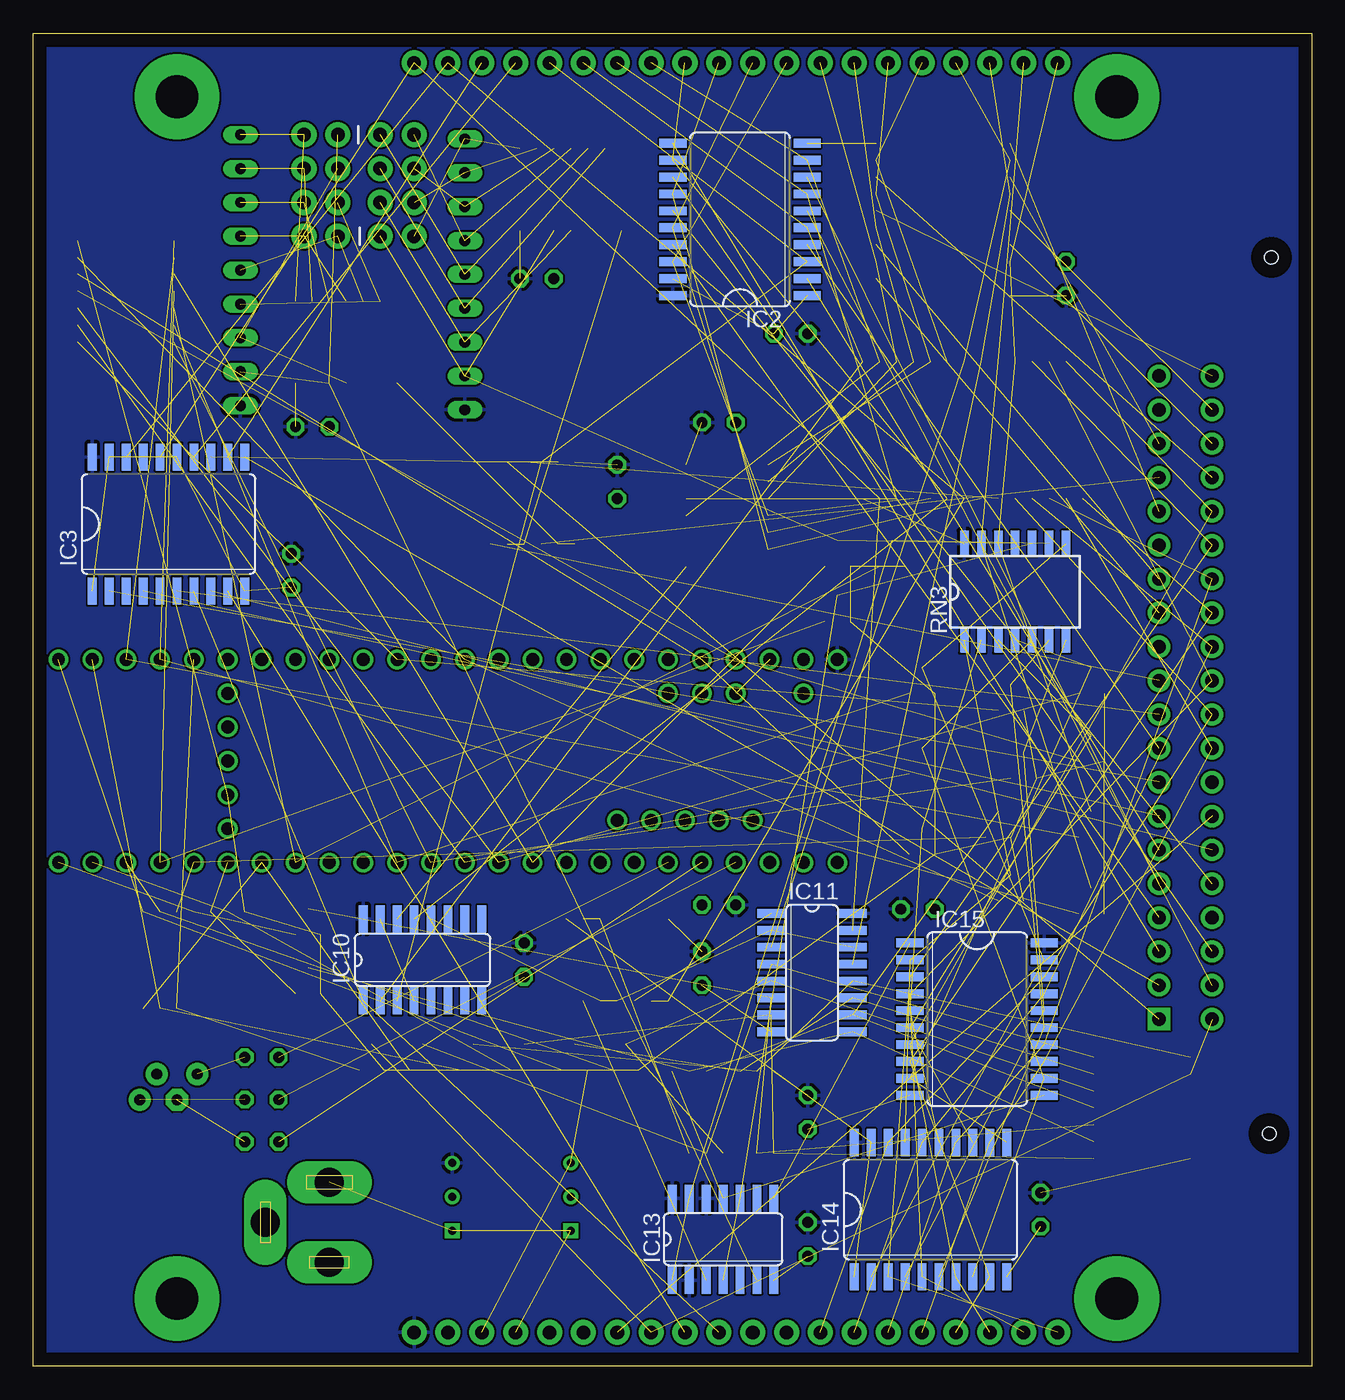
[diagram p4: board, bottom side, seen from below]

Size 95.86 x 100 mm. Coordinates in mm from the lower left corner, seen from the top.
Outline: 0,0 95.86,0 95.86,100 0,100 0,0
Copper layers (1*16): Top 0.035mm / dielectric 1.5mm / Bottom 0.035mm
Design rules "default": minimum track width 6mil, minimum drill 0.35mm, track to track 6mil, track to pad 6mil, pad to pad 6mil, via to via 6mil, smd to smd 6mil, copper to edge 40mil, drill to drill 6mil, minimum pad ring 10mil, minimum via ring 8mil, stop-mask expansion 4mil, vias tented up to drill 0mil, thermal gap 10mil

### Footprints (pad centres in the part's own frame; a part is rotated, then mirrored left to right if it is on the bottom)
C025-025X050 = drill 0.813 octagon: 1 -1.27,0; 2 1.27,0
STANDOFF-ELECTRICAL = drill 3.2 pad 6.35: P1 0,0
SO20W = smd 0.66 x 2.032: 1 -5.715,-5.029; 2 -4.445,-5.029; 3 -3.175,-5.029; 4 -1.905,-5.029; 5 -0.635,-5.029; 6 0.635,-5.029; 7 1.905,-5.029; 8 3.175,-5.029; 9 4.445,-5.029; 10 5.715,-5.029; 11 5.715,5.029; 12 4.445,5.029; 13 3.175,5.029; 14 1.905,5.029; 15 0.635,5.029; 16 -0.635,5.029; 17 -1.905,5.029; 18 -3.175,5.029; 19 -4.445,5.029; 20 -5.715,5.029
SO28L = smd 0.762 x 1.27: 1 -7.62,-5.207; 2 -6.35,-5.207; 3 -5.08,-5.207; 4 -3.81,-5.207; 5 -2.54,-5.207; 6 -1.27,-5.207; 7 0,-5.207; 8 1.27,-5.207; 9 2.54,-5.207; 10 3.81,-5.207; 11 5.08,-5.207; 12 6.35,-5.207; 13 7.62,-5.207; 14 8.89,-5.207; 15 8.89,5.08; 16 7.62,5.08; 17 6.35,5.08; 18 5.08,5.08; 19 3.81,5.08; 20 2.54,5.08; 21 1.27,5.08; 22 0,5.08; 23 -1.27,5.08; 24 -2.54,5.08; 25 -3.81,5.08; 26 -5.08,5.08; 27 -6.35,5.08; 28 -7.62,5.08
SO14 = smd 0.66 x 2.032: 1 -3.81,-3.073; 2 -2.54,-3.073; 3 -1.27,-3.073; 4 0,-3.073; 5 1.27,-3.073; 6 2.54,-3.073; 7 3.81,-3.073; 8 3.81,3.073; 9 2.54,3.073; 10 1.27,3.073; 11 0,3.073; 12 -1.27,3.073; 13 -2.54,3.073; 14 -3.81,3.073
SO16 = smd 0.66 x 2.032: 1 -4.445,-3.073; 2 -3.175,-3.073; 3 -1.905,-3.073; 4 -0.635,-3.073; 5 0.635,-3.073; 6 1.905,-3.073; 7 3.175,-3.073; 8 4.445,-3.073; 9 4.445,3.073; 10 3.175,3.073; 11 1.905,3.073; 12 0.635,3.073; 13 -0.635,3.073; 14 -1.905,3.073; 15 -3.175,3.073; 16 -4.445,3.073
2X4 = drill 1.016 pad 1.88: 1 -3.81,-1.27; 2 -3.81,1.27; 3 -1.27,-1.27; 4 -1.27,1.27; 5 1.27,-1.27; 6 1.27,1.27; 7 3.81,-1.27; 8 3.81,1.27
1X20 = drill 1.016 pad 1.88: 1 0,0; 2 2.54,0; 3 5.08,0; 4 7.62,0; 5 10.16,0; 6 12.7,0; 7 15.24,0; 8 17.78,0; 9 20.32,0; 10 22.86,0; 11 25.4,0; 12 27.94,0; 13 30.48,0; 14 33.02,0; 15 35.56,0; 16 38.1,0; 17 40.64,0; 18 43.18,0; 19 45.72,0; 20 48.26,0
SOT23-3 = smd 0.62 x 1.1: 1 -0.95,-0.975; 2 0.95,-0.975; 3 0,0.975
0207/2V = drill 0.813 octagon: 1 -1.27,0; 2 1.27,0
TRACON_REG = drill 0.6 square: P$1 0,0 | drill 0.6: P$2 2.54,0; P$3 5.08,0
LED5MMRGB = drill 0.8 pad 1.676: 1 -2.159,0.968; 3 0.889,0.968; 4 2.159,-0.968 | drill 0.8 pad 1.676 octagon: 2 -0.635,-0.968
SIL9 = drill 0.813 long: 1 -10.16,0; 2 -7.62,0; 3 -5.08,0; 4 -2.54,0; 5 0,0; 6 2.54,0; 7 5.08,0; 8 7.62,0; 9 10.16,0
SOMC14 = smd 1.91 x 0.64: 1 -3.62,3.81; 2 -3.62,2.54; 3 -3.62,1.27; 4 -3.62,0; 5 -3.62,-1.27; 6 -3.62,-2.54; 7 -3.62,-3.81; 8 3.62,-3.81; 9 3.62,-2.54; 10 3.62,-1.27; 11 3.62,0; 12 3.62,1.27; 13 3.62,2.54; 14 3.62,3.81
EBC20DRAS = drill 1 pad 1.676 square: P$1 0,0 | drill 1 pad 1.676: P$2 0,3.969; P$3 2.54,0; P$4 2.54,3.969; P$5 5.08,0; P$6 5.08,3.969; P$7 7.62,0; P$8 7.62,3.969; P$9 10.16,0; P$10 10.16,3.969; P$11 12.7,0; P$12 12.7,3.969; P$13 15.24,0; P$14 15.24,3.969; P$15 17.78,0; P$16 17.78,3.969; P$17 20.32,0; P$18 20.32,3.969; P$19 22.86,0; P$20 22.86,3.969; P$21 25.4,0; P$22 25.4,3.969; P$23 27.94,0; P$24 27.94,3.969; P$25 30.48,0; P$26 30.48,3.969; P$27 33.02,0; P$28 33.02,3.969; P$29 35.56,0; P$30 35.56,3.969; P$31 38.1,0; P$32 38.1,3.969; P$33 40.64,0; P$34 40.64,3.969; P$35 43.18,0; P$36 43.18,3.969; P$37 45.72,0; P$38 45.72,3.969; P$39 48.26,0; P$40 48.26,3.969 | hole 1: -8.572,8.255; 57.15,8.414
SPC4077 = drill 2.184 pad 2.184 long: 1 -3,0; 2 0,-4.8; 3 3,0
TEENSY_3.5/3.6 = drill 0.965: 0/RX -25.4,-7.62; 1/TX -22.86,-7.62; 2 -20.32,-7.62; 3/CANTX -17.78,-7.62; 3V3 7.62,-7.62; 3V3_2 17.78,-2.54; 3V3_LO -22.86,7.62; 4/CANRX -15.24,-7.62; 5 -12.7,-7.62; 6 -10.16,-7.62; 7 -7.62,-7.62; 8 -5.08,-7.62; 9/CS -2.54,-7.62; 10/CS 0,-7.62; 11/MOSI 2.54,-7.62; 12/MISO 5.08,-7.62; 13/SCK 5.08,7.62; 14/A0 2.54,7.62; 15/A1 0,7.62; 16/A2 -2.54,7.62; 17/A3 -5.08,7.62; 18/A4/SDA -7.62,7.62; 19/A5/SCL -10.16,7.62; 20/A6 -12.7,7.62; 21/A7 -15.24,7.62; 21/DAC0 12.7,7.62; 22/A8 -17.78,7.62; 23/A9 -20.32,7.62; 24 10.16,-7.62; 25 12.7,-7.62; 26 15.24,-7.62; 27 17.78,-7.62; 28 20.32,-7.62; 29 22.86,-7.62; 30 25.4,-7.62; 31/A12 27.94,-7.62; 32/A13 30.48,-7.62; 33/A14 30.48,7.62; 34/A15 27.94,7.62; 35/A16 25.4,7.62; 36/A17 22.86,7.62; 37/A18 20.32,7.62; 38/A19 17.78,7.62; 39/A20 15.24,7.62; A10 -17.78,5.08; A11 -15.24,5.08; A22/DAC1 10.16,7.62; AGND -25.4,7.62; AREF -20.32,5.08; GND -27.94,-7.62; GND2 7.62,7.62; GND3 17.78,0; PROG 17.78,2.54; RESET 17.78,5.08; U5V -21.59,-4.445; UD+ -16.51,-4.445; UD- -19.05,-4.445; UGND1 -13.97,-4.445; UGND2 -11.43,-4.445; VBAT 17.78,-5.08; VIN -27.94,7.62; VUSB -25.4,5.08

### Placement (x,y rotation side)
C1  39.05,77.47 0 top
C2  76.52,59.69 270 top
C3  44.45,70.8 180 top
C4  45.72,29.84 270 top
C5  59.05,30.48 270 top
C6  52.07,66.36 270 top
C7  58.1,81.6 180 top
C8  18.41,81.6 90 top
C9  44.45,34.61 0 top
C10  74.93,70.48 180 top
C11  37.78,19.05 270 top
C12  37.78,9.53 270 top
C13  20.32,11.75 270 top
C14  29.53,34.29 180 top
H1  85.09,5.08 0 top
H2  85.09,95.25 0 top
H3  14.61,95.25 0 top
H4  14.61,5.08 0 top
IC1  27.62,86.04 90 top
IC2  42.86,86.04 90 bottom
IC3  85.72,63.18 0 bottom
IC4  26.04,70.17 180 top
IC5  55.56,88.27 180 top
IC6  59.05,64.77 0 top
IC7  72.39,76.83 180 top
IC8  52.07,30.48 0 top
IC9  43.81,63.82 270 top
IC10  66.67,30.48 0 bottom
IC11  37.47,29.53 270 bottom
IC12  44.13,19.05 0 top
IC13  44.13,9.53 0 bottom
IC14  28.57,11.75 0 bottom
IC15  25.08,26.04 270 bottom
J1-INTERRUPTS  68.58,88.58 90 top
J1_ADDRESS_CON  19.05,97.79 0 top
J2-WAITS  74.3,88.58 270 top
J2_DATA_AND_POWER_CON  67.31,2.54 180 top
Q1  22.54,35.88 0 top
Q2  29.21,39.37 0 top
Q3  16.51,46.35 0 top
Q4  16.51,51.44 0 top
Q5  29.21,45.4 0 top
Q6  22.54,50.16 0 top
Q7  21.59,45.09 0 top
Q8  29.21,51.44 0 top
Q9  31.43,60.96 0 top
Q10  35.56,56.83 0 top
Q11  35.56,60.96 0 top
Q12  16.51,40.64 0 top
Q13  16.51,34.92 0 top
Q14  59.05,23.18 0 top
Q15  75.25,28.89 0 top
Q16  75.25,33.34 0 top
Q17  23.5,40.64 0 top
Q18  51.44,23.18 0 top
Q19  55.24,23.18 0 top
Q20  66.67,23.18 0 top
Q21  62.87,23.18 0 top
Q22  70.48,23.18 0 top
R1  78.74,23.18 0 top
R2  78.74,16.83 0 top
R3  78.74,20 0 top
REG1-5V  64.45,10.16 90 top
REG2-3.3V  55.56,10.16 90 top
RGB_LED  85.72,20.95 0 top
RN1  80.33,82.23 90 top
RN2  63.5,81.92 90 top
RN3  22.23,58.1 90 bottom
RN4  88.9,80.64 0 top
RN5  12.7,19.37 180 top
RN6  83.82,30.48 90 top
U$1  11.43,26.04 90 top
U$2  73.66,10.79 90 top
U$3  63.5,45.4 0 top

### Tracks (layer width: path | path; a pad name or v marks a point on that pad's centre or on a via)
3XXX_  (1 unrouted)
9V-IN  (3 unrouted)
37E0RD_  (3 unrouted)
37E0RD_LV  (2 unrouted)
37E0WR_  (3 unrouted)
37E0WR_LV  (2 unrouted)
37E4RD_  (3 unrouted)
37E4RD_LV  (2 unrouted)
37E4WR_  (3 unrouted)
37E4WR_LV  (2 unrouted)
37E8RD_  (3 unrouted)
37E8RD_LV  (2 unrouted)
37E8WR_  (3 unrouted)
37E8WR_LV  (2 unrouted)
37ECRD_  (3 unrouted)
37ECRD_LV  (2 unrouted)
37ECWR_  (3 unrouted)
37ECWR_LV  (2 unrouted)
37EX  (1 unrouted)
37EX_  (4 unrouted)
37EXRD  (2 unrouted)
37EXRD_  (2 unrouted)
37EXWR  (2 unrouted)
37EXWR_OUTPUT_ENABLE_  (1 unrouted)
A0  (1 unrouted)
A0_LV  (2 unrouted)
A1  (1 unrouted)
A1_LV  (2 unrouted)
A2  (1 unrouted)
A3  (1 unrouted)
A4  (1 unrouted)
A5  (1 unrouted)
A6  (1 unrouted)
A7  (1 unrouted)
A8  (1 unrouted)
A9  (1 unrouted)
A10  (1 unrouted)
A11  (1 unrouted)
A12  (1 unrouted)
A13  (1 unrouted)
A14  (1 unrouted)
A15  (1 unrouted)
A15_AND_RAS  (1 unrouted)
BUFFERED_A0  (4 unrouted)
BUFFERED_A1  (4 unrouted)
BUFFERED_A2  (3 unrouted)
BUFFERED_A3  (3 unrouted)
BUFFERED_A4  (2 unrouted)
BUFFERED_A5  (3 unrouted)
BUFFERED_A6  (3 unrouted)
BUFFERED_A7  (3 unrouted)
BUFFERED_A8  (3 unrouted)
BUFFERED_A9  (3 unrouted)
BUFFERED_A10  (3 unrouted)
BUFFERED_A11  (3 unrouted)
BUFFERED_A12  (3 unrouted)
BUFFERED_A13  (3 unrouted)
BUFFERED_A14  (3 unrouted)
BUFFERED_A15  (3 unrouted)
BUFFERED_CAS*  (1 unrouted)
BUFFERED_IN*  (1 unrouted)
BUFFERED_OUT*  (1 unrouted)
BUFFERED_RAS*  (2 unrouted)
BUFFERED_RD*  (4 unrouted)
BUFFERED_WR*  (3 unrouted)
CAS*  (1 unrouted)
D0  (4 unrouted)
D0_HV  (3 unrouted)
D0_LV  (2 unrouted)
D1  (4 unrouted)
D1_HV  (3 unrouted)
D1_LV  (2 unrouted)
D2  (4 unrouted)
D2_HV  (3 unrouted)
D2_LV  (2 unrouted)
D3  (4 unrouted)
D3_HV  (3 unrouted)
D3_LV  (2 unrouted)
D4  (4 unrouted)
D4_HV  (3 unrouted)
D4_LV  (2 unrouted)
D5  (4 unrouted)
D5_HV  (3 unrouted)
D5_LV  (2 unrouted)
D6  (4 unrouted)
D6_HV  (3 unrouted)
D6_LV  (2 unrouted)
D7  (4 unrouted)
D7_HV  (3 unrouted)
D7_LV  (2 unrouted)
FLIPFLOP_CLR_HV  (3 unrouted)
FLIPFLOP_CLR_LV  (2 unrouted)
FLIPFLOP_PRE_HV  (3 unrouted)
FLIPFLOP_PRE_LV  (2 unrouted)
GND  (13 unrouted)
  pour Top: 0,100.33 0,0 96.2,0 96.2,100.33
IN*  (1 unrouted)
INT  (2 unrouted)
INT1*  (2 unrouted)
INT2*  (2 unrouted)
INT3*  (2 unrouted)
INT4*  (2 unrouted)
INT5*  (2 unrouted)
INT6*  (2 unrouted)
INT7*  (2 unrouted)
INT*  (1 unrouted)
INT_HV_  (4 unrouted)
INT_LV_  (2 unrouted)
INTAK*  (1 unrouted)
N$1  (1 unrouted)
N$2  (1 unrouted)
N$3  (1 unrouted)
N$4  (1 unrouted)
N$5  (1 unrouted)
N$6  (1 unrouted)
N$7  (1 unrouted)
OUT*  (1 unrouted)
RAS  (1 unrouted)
RAS*  (3 unrouted)
RD  (1 unrouted)
RD*  (1 unrouted)
SYSRES*  (3 unrouted)
SYSRES_LV_  (2 unrouted)
VCC  (9 unrouted)
  pour Bottom: 0,100.33 0,0 95.89,0 95.89,100.33
VCC/2  (26 unrouted)
WAIT  (2 unrouted)
WAIT0*  (2 unrouted)
WAIT1*  (2 unrouted)
WAIT2*  (2 unrouted)
WAIT3*  (2 unrouted)
WAIT4*  (2 unrouted)
WAIT5*  (2 unrouted)
WAIT6*  (2 unrouted)
WAIT7*  (3 unrouted)
WAIT*  (1 unrouted)
WR*  (1 unrouted)
XX11X111111XXXX  (1 unrouted)

### Text on the board
tNames: A0 | A2 | A4 | A6 | A8 | A10 | A12 | A14 | IN* | RD* | A1 | A3 | A5 | A7 | A9 | A11 | A13 | A15 | OUT* | WR* | INT* | WAIT* | 4.7k | TRS80MXS Base - V1.3 / Joe Rounceville (C) 2020 | 10uf | RAS* | 3.3V | 5V | D1 | D3 | D5 | D7 | CAS* | D0 | D2 | D4 | D6 | RES* | INTAK* | 3.3V | GND | 5V